# EAGLE design pragotron-master-clock-1.0 (EAGLE 9.6.2)
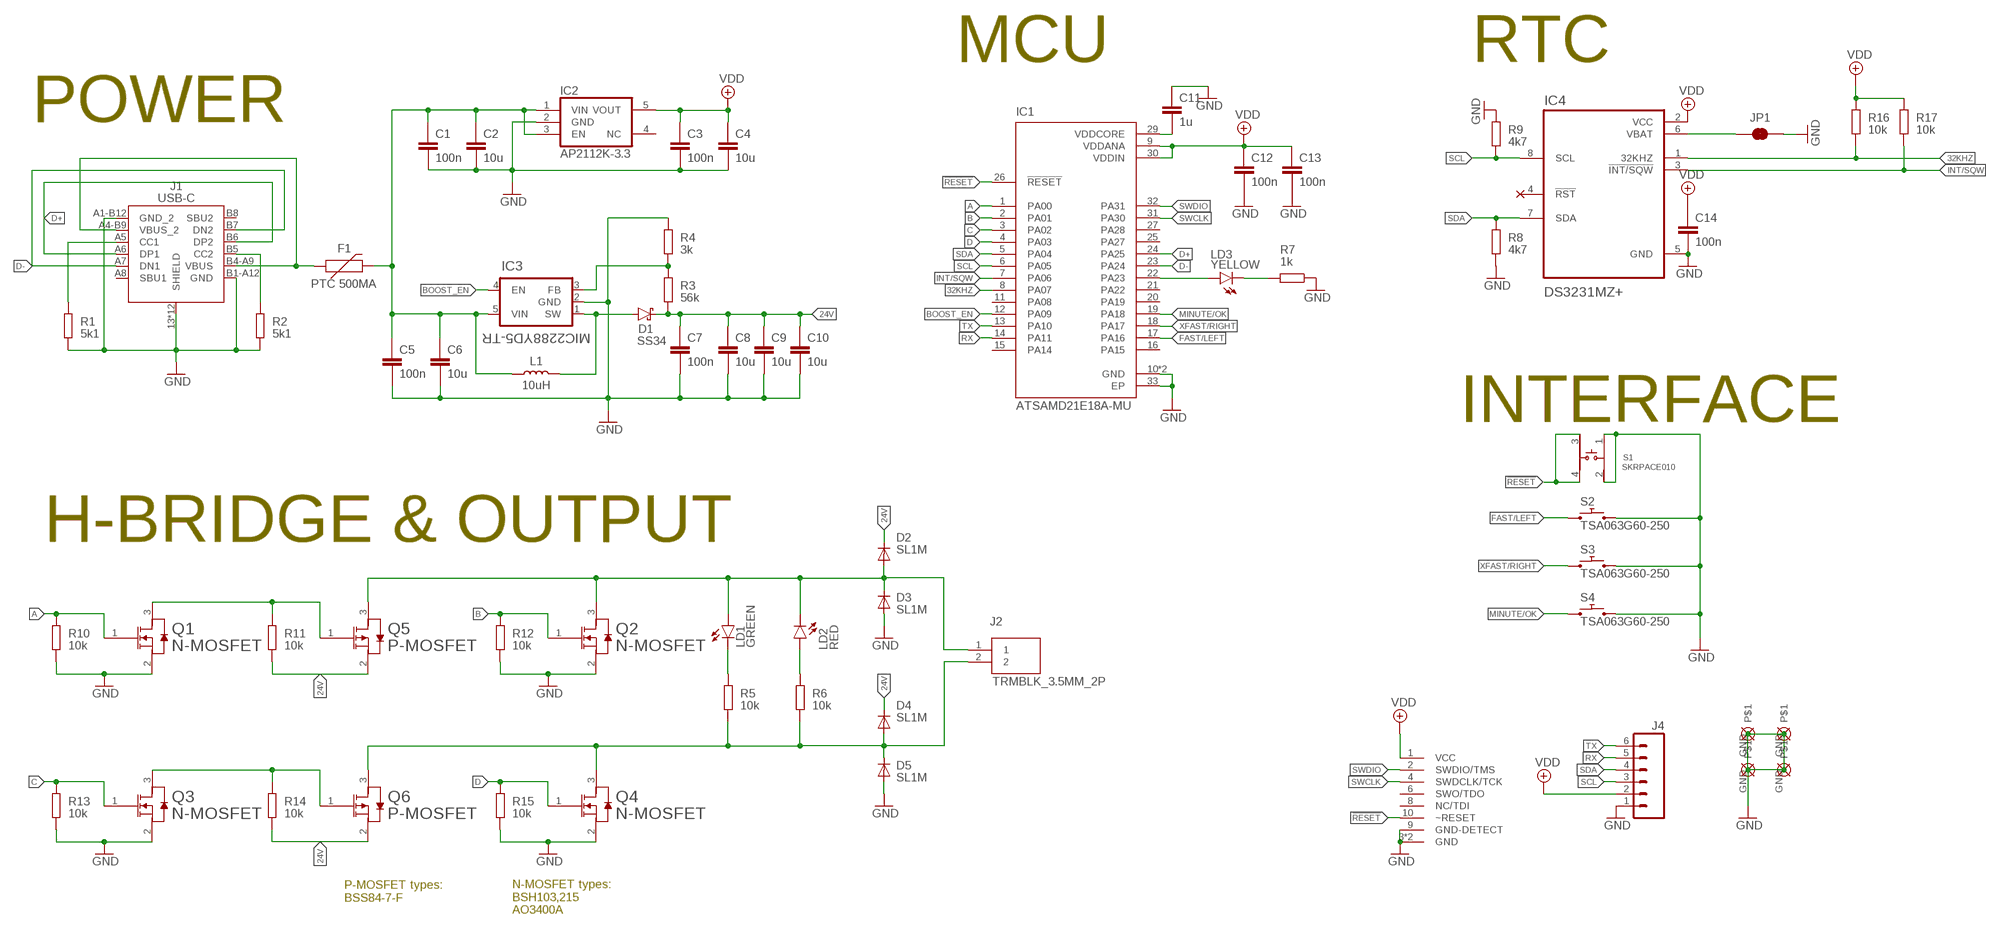
[diagram p0: schematic, sheet 1]

## Parts
C1  100n  CAPACITOR0603  [CAPACITOR0603]
C2  10u  CAPACITOR0805  [CAPACITOR0805]
C3  100n  CAPACITOR0603  [CAPACITOR0603]
C4  10u  CAPACITOR0805  [CAPACITOR0805]
C5  100n  CAPACITOR0603  [CAPACITOR0603]
C6  10u  CAPACITOR0805  [CAPACITOR0805]
C7  100n  CAPACITOR0603  [CAPACITOR0603]
C8  10u  CAPACITOR0805  [CAPACITOR0805]
C9  10u  CAPACITOR0805  [CAPACITOR0805]
C10  10u  CAPACITOR0805  [CAPACITOR0805]
C11  1u  CAPACITOR0603  [CAPACITOR0603]
C12  100n  CAPACITOR0603  [CAPACITOR0603]
C13  100n  CAPACITOR0603  [CAPACITOR0603]
C14  100n  CAPACITOR0603  [CAPACITOR0603]
D1  SS34  [SMA]
D2  SL1M  [SOD123]
D3  SL1M  [SOD123]
D4  SL1M  [SOD123]
D5  SL1M  [SOD123]
F1  PTC 500MA  PTC200MA  [PTC0805]
H1  HOLE_3MM_GND_CORNER  [3MM_HOLE_GND_CORNER]
H2  HOLE_3MM_GND_CORNER  [3MM_HOLE_GND_CORNER]
H3  HOLE_3MM_GND_CORNER  [3MM_HOLE_GND_CORNER]
H4  HOLE_3MM_GND_CORNER  [3MM_HOLE_GND_CORNER]
IC1  ATSAMD21E18A-MU  [QFN50P500X500X100-33N]
IC2  AP2112K-3.3  AP2205-W5-7  [SOT23-5]
IC3  MIC2288YD5-TR  [SOT23-5]
IC4  DS3231MZ+  [SO8]
J1  USB-C  [USB-C]
J2  TRMBLK_3.5MM_2P  [TRMBLK_3.5MM_2P]
J3  2X5_PITCH_1.27MMTH_NOKEY_UNSHROUDED  [CON-CORTEX_2X5_0.05"_TH_NS]
J4  M06NO_SILK  [1X06_NO_SILK]
JP1  JUMPER-SMT_2_NC_TRACE_NO-SILK  [SMT-JUMPER_2_NC_TRACE_NO-SILK]
L1  10uH  ETQP3MXXXKVP  [ETQP3MXXXKVP]
LD1  GREEN  LED_SMT  [LED_0603]
LD2  RED  LED_SMT  [LED_0603]
LD3  YELLOW  LED_SMT  [LED_0603]
Q1  N-MOSFET  [SOT23]
Q2  N-MOSFET  [SOT23]
Q3  N-MOSFET  [SOT23]
Q4  N-MOSFET  [SOT23]
Q5  P-MOSFET  [SOT23]
Q6  P-MOSFET  [SOT23]
R1  5k1  RESISTOR0603  [RESISTOR0603]
R2  5k1  RESISTOR0603  [RESISTOR0603]
R3  56k  RESISTOR0603  [RESISTOR0603]
R4  3k  RESISTOR0603  [RESISTOR0603]
R5  10k  RESISTOR0603  [RESISTOR0603]
R6  10k  RESISTOR0603  [RESISTOR0603]
R7  1k  RESISTOR0603  [RESISTOR0603]
R8  4k7  RESISTOR0603  [RESISTOR0603]
R9  4k7  RESISTOR0603  [RESISTOR0603]
R10  10k  RESISTOR0603  [RESISTOR0603]
R11  10k  RESISTOR0603  [RESISTOR0603]
R12  10k  RESISTOR0603  [RESISTOR0603]
R13  10k  RESISTOR0603  [RESISTOR0603]
R14  10k  RESISTOR0603  [RESISTOR0603]
R15  10k  RESISTOR0603  [RESISTOR0603]
R16  10k  RESISTOR0603  [RESISTOR0603]
R17  10k  RESISTOR0603  [RESISTOR0603]
S1  SKRPACE010  [SKRPACE010]
S2  TSA063G60-250  PUSH_MOMENTARY_SMT_6X6MM_SMALL_PADS  [TACTILE-SMT-SMALL-PADS]
S3  TSA063G60-250  PUSH_MOMENTARY_SMT_6X6MM_SMALL_PADS  [TACTILE-SMT-SMALL-PADS]
S4  TSA063G60-250  PUSH_MOMENTARY_SMT_6X6MM_SMALL_PADS  [TACTILE-SMT-SMALL-PADS]

## Nets
24V: C7.1 C8.1 C9.1 C10.1 D1.C D2.C D4.C Q5.2(SOURCE) Q6.2(SOURCE) R3.1 R11.1 R14.1
32KHZ: IC1.8(PA07) IC4.1(32KHZ) R16.1
!RESET: IC1.26(!RESET) J3.10(~RESET) S1.3 S1.4
A: IC1.1(PA00) Q1.1(GATE) R10.2
B: IC1.2(PA01) Q2.1(GATE) R12.2
BOOST_EN: IC1.12(PA09) IC3.4(EN)
C: IC1.3(PA02) Q3.1(GATE) R13.2
D: IC1.4(PA03) Q4.1(GATE) R15.2
D+: IC1.24(PA25) J1.A6(DP1) J1.B6(DP2)
D-: IC1.23(PA24) J1.A7(DN1) J1.B7(DN2)
FAST/LEFT: IC1.17(PA16) S2.1 S2.2
GND: C1.2 C2.2 C3.2 C4.2 C5.2 C6.2 C7.2 C8.2 C9.2 C10.2 C11.1 C12.2 C13.2 C14.2 D3.A D5.A H1.GND H2.GND H3.GND H4.GND IC1.10(GND) IC1.28(GND) IC1.33(EP) IC2.2(GND) IC3.2(GND) IC4.5(GND) J1.13(SHIELD) J1.14(SHIELD) J1.15(SHIELD) J1.16(SHIELD) J1.A1-B12(GND_2) J1.B1-A12(GND) J1.S_1_H1(SHIELD) J1.S_1_H2(SHIELD) J1.S_2_H1(SHIELD) J1.S_2_H2(SHIELD) J1.S_3_H1(SHIELD) J1.S_3_H2(SHIELD) J1.S_4_H1(SHIELD) J1.S_4_H2(SHIELD) J3.3(GND) J3.5(GND) J3.9(GND-DETECT) J4.1 JP1.2 Q1.2(SOURCE) Q2.2(SOURCE) Q3.2(SOURCE) Q4.2(SOURCE) R1.1 R2.1 R4.2 R7.1 R8.1 R9.2 R10.1 R12.1 R13.1 R15.1 S1.1 S1.2 S2.3 S2.4 S3.3 S3.4 S4.3 S4.4
INT/SQW: IC1.7(PA06) IC4.3(!INT/SQW) R17.1
MINUTE/OK: IC1.19(PA18) S4.1 S4.2
N$1: IC3.3(FB) R3.2 R4.1
N$2: D1.A IC3.1(SW) L1.2
N$3: F1.2 J1.A4-B9(VBUS_2) J1.B4-A9(VBUS)
N$4: C1.1 C2.1 C5.1 C6.1 F1.3 IC2.1(VIN) IC2.3(EN) IC3.5(VIN) L1.1
N$5: J1.A5(CC1) R1.2
N$6: J1.B5(CC2) R2.2
N$8: LD2.A R6.2
N$9: C11.2 IC1.29(VDDCORE)
N$10: IC1.22(PA23) LD3.A
N$11: LD3.K(C) R7.2
N$12: IC4.6(VBAT) JP1.1
N$13: LD1.K(C) R5.2
N$17: Q1.3(DRAIN) Q5.1(GATE) R11.2
N$19: Q3.3(DRAIN) Q6.1(GATE) R14.2
OUT_1: D2.A D3.C J2.1 LD1.A LD2.K(C) Q2.3(DRAIN) Q5.3(DRAIN)
OUT_2: D4.A D5.C J2.2 Q4.3(DRAIN) Q6.3(DRAIN) R5.1 R6.1
RX: IC1.14(PA11) J4.5
SCL: IC1.6(PA05) IC4.8(SCL) J4.3 R9.1
SDA: IC1.5(PA04) IC4.7(SDA) J4.4 R8.2
SWCLK: IC1.31(PA30) J3.4(SWDCLK/TCK)
SWDIO: IC1.32(PA31) J3.2(SWDIO/TMS)
TX: IC1.13(PA10) J4.6
VDD: C3.1 C4.1 C12.1 C13.1 C14.1 IC1.9(VDDANA) IC1.30(VDDIN) IC2.5(VOUT) IC4.2(VCC) J3.1(VCC) J4.2 R16.2 R17.2
XFAST/RIGHT: IC1.18(PA17) S3.1 S3.2
Unconnected: IC1.11(PA08) IC1.15(PA14) IC1.16(PA15) IC1.20(PA19) IC1.21(PA22) IC1.25(PA27) IC1.27(PA28) IC2.4(NC) IC4.4(!RST) J1.A8(SBU1) J1.B8(SBU2) J3.6(SWO/TDO) J3.8(NC/TDI)

## Notes on the sheet
- MCU | RTC
- POWER
- INTERFACE
- H-BRIDGE & OUTPUT
- P-MOSFET types:
  BSS84-7-F
- N-MOSFET types:
  BSH103,215
  AO3400A

## Library data of the parts
C1 C3 C5 C7 C11-C14 = BASTL_CAPACITORS:CAPACITOR0603; ODOO: 0.1; SIZEX: 0.85; SIZEY: 1.55; SIZEZ: 0.8; TYPE: SMT
C2 C4 C6 C8-C10 = BASTL_CAPACITORS:CAPACITOR0805; ODOO: 0.1; SIZEX: 1.2; SIZEY: 2; SIZEZ: 1.2; TYPE: SMT
D1 = BASTL_DIODES:SS34: Diode Schottky 40V 3A 2-Pin SMA
D2-D5 = BASTL_DIODES:SL1M: diode instead of 1N4007; MAN: DIOTEC SEMICONDUCTOR; MPN: SL1M; ODOO: D_SL1M_SOD123; PRICE: 0.5; SIZEX: 1.55; SIZEY: 2.65; SIZEZ: 0.9; TYPE: SMT; WEB: https://www.tme.eu/cz/details/sl1m-dio/univerzalni-diody-smd/diotec-semiconductor/sl1m/
F1 = BASTL_FUSES:PTC; MAN: ECE; MPN: SR020-09; ODOO: F_PTC_200MA_0805; PRICE: 3.2; SIZEX: 1.2; SIZEY: 2; SIZEZ: 0.5; TYPE: SMT; WEB: https://www.tme.eu/cz/details/sr020-09/polymerove-pojistky-smd/ece/
H1-H4 = BASTL_HOLES:HOLE_3MM_GND
IC1 = BASTL_ICS:ATSAMD21E18A-MU: SAMD21E Series 256 KB Flash 32 KB SRAM 48 MHz 32-Bit Microcontroller - QFN-32; CHECK_PRICES: https://www.snapeda.com/parts/ATSAMD21E18A-MU/Microchip/view-part/?ref=eda; DESCRIPTION: ARM® Cortex®-M0+ SAM D21E, Functional Safety (FuSa) Microcontroller IC 32-Bit Single-Core 48MHz 256KB (256K x 8) FLASH 32-VQFN (5x5); DIGIKEY_PART_NUMBER: ATSAMD21E18A-MU-ND; MF: Microchip; MP: ATSAMD21E18A-MU; PACKAGE: QFN-32 Microchip; PURCHASE-URL: https://www.snapeda.com/api/url_track_click_mouser/?unipart_id=227694&manufacturer=Microchip&part_name=ATSAMD21E18A-MU&search_term=None; SNAPEDA_LINK: https://www.snapeda.com/parts/ATSAMD21E18A-MU/Microchip/view-part/?ref=snap
IC2 = BASTL_VOLTAGE REGULATORS:AP2205-W5-7: alt: AP2204K-5.0TRG1 AP2205-W5-7 LD2985BM50R LP2981AIM5-5.0/NOPB
IC3 = BASTL_ICS:MIC2288YD5-TR: DigiKey, Mouser: MIC2288YD5-TR LCSC: MT3540-F23
IC4 = BASTL_ICS:DS3231MZ+; DESCRIPTION: Real Time Clock (RTC) IC Clock/Calendar I²C, 2-Wire Serial 8-SOIC (0.154, 3.90mm Width); DIGI-KEY_PART_NUMBER: DS3231MZ+-ND; MF: Maxim Integrated Products; MP: DS3231MZ+; PACKAGE: None
J1 = BASTL_CONNECTORS:USB-C: DigiKey: USB4105-GF-A LCSC: C165948
J2 = BASTL_CONNECTORS:TRMBLK_3.5MM_2P: TE 1546551-2 Würth Elektronik 691214110002 Phoenix Contact 5442248 Adam Tech EBWA-02-A
J3 = BASTL_PINHEADER_1.27mm:2X5_PITCH_1.27MM; TYPE: THT
J4 = BASTL_PINHEADERS:M06: Header 6 Standard 6-pin 0.1" header. Use with straight break away headers (SKU : PRT-00116), right angle break away headers (PRT-00553), swiss pins (PRT-00743), machine pins (PRT-00117), and female headers (PRT-00115). Molex polarized connector foot print use with SKU : PRT-08094 with associated crimp pins and housings. NOTES ON THE VARIANTS LOCK and LOCK_LONGPADS... This footprint was designed to help hold the alignment of a through-hole component (i.e. 6-pin header) while soldering it into place. You may notice that each hole has been shifted either up or down by 0.005 of an inch from it's more standard position (which is a perfectly straight line). This slight alteration caused the pins (the squares in the middle) to touch the edges of the holes. Because they are alternating, it causes a "brace" to hold the component in place. 0.005 has proven to be the perfect amount of "off-center" position when using our standard breakaway headers. Although looks a little odd when you look at the bare footprint, once you have a header in there, the alteration is very hard to notice. Also,if you push a header all the way into place, it is covered up entirely on the bottom side. This idea of altering the position of holes to aid alignment will be further integrated into the Sparkfun Library for other footprints. It can help hold any component with 3 or more connection pins.
JP1 = BASTL_JUMPERS:JUMPER-SMT_2_NC_TRACE: Normally closed trace jumper This jumper has a trace between two pads so it's normally closed (NC). Use a razor knife to open the connection. For best results follow the IPC guidelines for cutting traces: Cutout at least 0.063 mm (0.005 in). Remove all loose material to clean up the cut area. Seal the cut with an approved epoxy. Reapply solder to reclose the connection.
L1 = BASTL_INDUCTORS:ETQP3MXXXKVP; DIGI-KEY_PART_NUMBER: P19755TR-ND; MF: Panasonic; MP: ETQP3M100KVP
LD1-LD3 = BASTL_LEDS:LED_SMT; TYPE: SMT
Q1-Q4 = BASTL_TRANZISTORS:N-MOSFET
Q5 Q6 = BASTL_TRANZISTORS:P-MOSFET
R1-R17 = BASTL_RESISTORS:RESISTOR0603; ASSEMBLED: yes; PRICE: 0.1; SIZEX: 0.85; SIZEY: 1.55; SIZEZ: 0.5; TYPE: SMT
S1 = BASTL_SWITCHES:SKRPACE010: Switch Tactile N.O. SPST Button J-Bend 0.05A 16VDC 2.55N SMD Automotive T/R Check availability <https://pricing.snapeda.com/parts/SKRPACE010/ALPS/view-part?ref=eda>; AVAILABILITY: In Stock; CHECK_PRICES: https://www.snapeda.com/parts/SKRPACE010/ALPS/view-part/?ref=eda; DESCRIPTION: Switch Tactile N.O. SPST Button J-Bend 0.05A 16VDC 2.55N SMD Automotive T/R; MF: ALPS; MP: SKRPACE010; PACKAGE: None; PRICE: None; PURCHASE-URL: https://www.snapeda.com/api/url_track_click_mouser/?unipart_id=376136&manufacturer=ALPS&part_name=SKRPACE010&search_term=None; SNAPEDA_LINK: https://www.snapeda.com/parts/SKRPACE010/ALPS/view-part/?ref=snap
S2-S4 = BASTL_SWITCHES:PUSH_MOMENTARY: Various NO switches- pushbuttons, reed, etc THT: TL1105SPF100Q SMT: TL3301SPF100QG, TL3301SPF160QG...

## Board
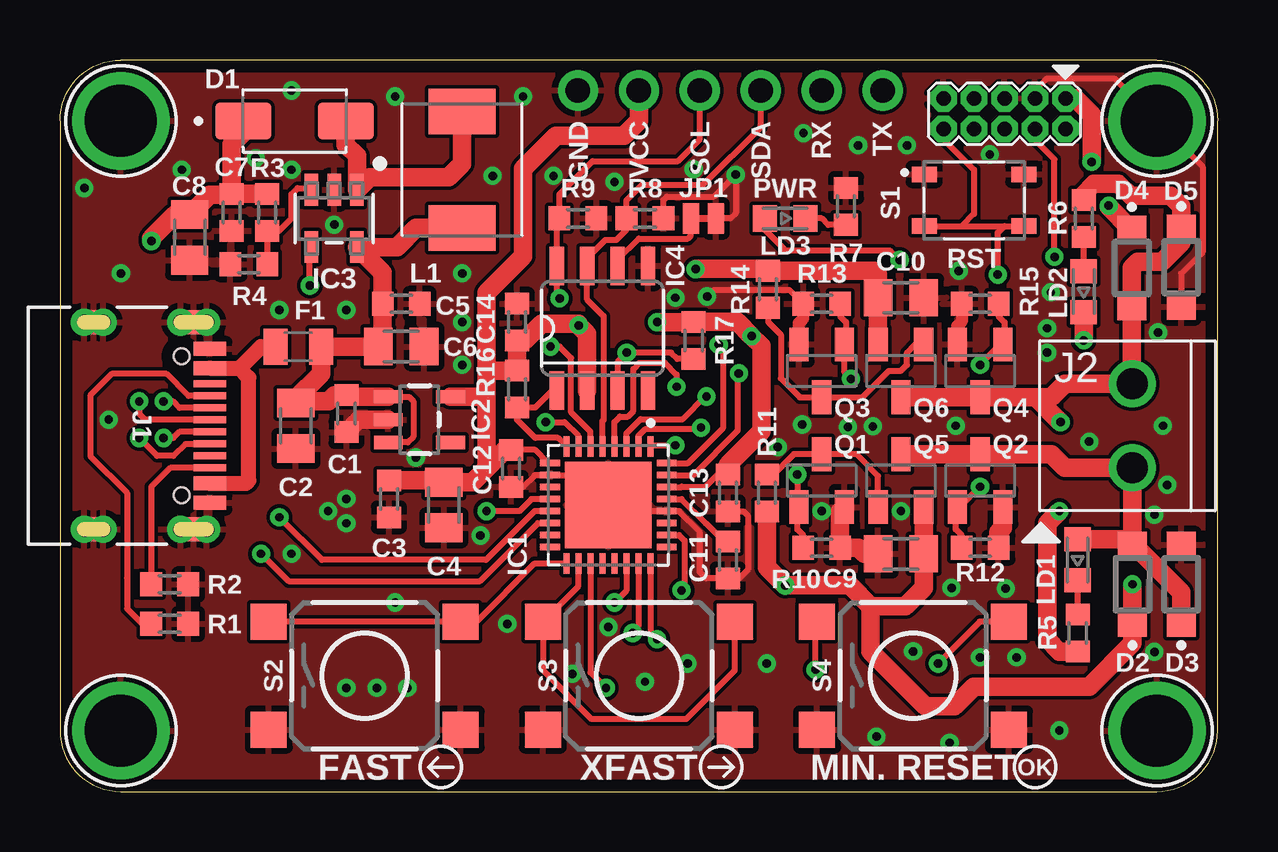
[diagram p1: board, top side]
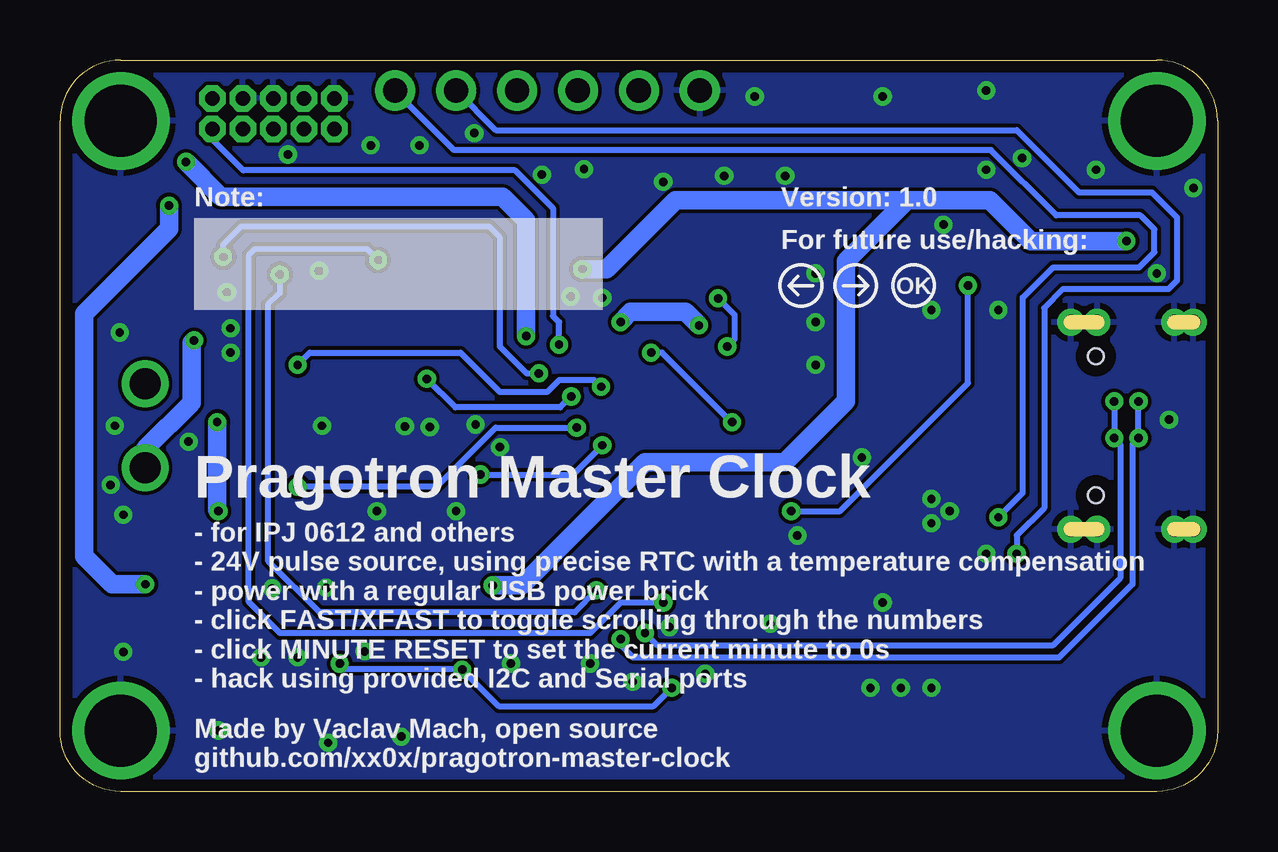
[diagram p2: board, bottom side, seen from below]

Size 48.26 x 30.48 mm. Coordinates in mm from the lower left corner, seen from the top.
Outline: 2.54,0 45.72,0 arc90 48.26,2.54 48.26,27.94 arc90 45.72,30.48 2.54,30.48 arc90 0,27.94 0,2.54 arc90 2.54,0
Copper layers (1*16): Top 0.035mm / dielectric 1.5mm / Bottom 0.035mm
Design rules "default_tenting_vias": minimum track width 6mil, minimum drill 0.35mm, track to track 6mil, track to pad 6mil, pad to pad 6mil, via to via 6mil, smd to smd 6mil, copper to edge 20mil, drill to drill 6mil, minimum pad ring 10mil, minimum via ring 8mil, stop-mask expansion 4mil, vias tented up to drill 15mil, thermal gap 10mil

### Footprints (pad centres in the part's own frame; a part is rotated, then mirrored left to right if it is on the bottom)
CAPACITOR0603 = smd 0.9 x 1: 1 -0.771,0; 2 0.771,0
CAPACITOR0805 = smd 1.2 x 1.55: 1 -0.95,0; 2 0.95,0
SMA = smd 2.33 x 1.55: A 2.135,0; C -2.135,0
SOD123 = smd 1.05 x 1.2: A 1.654,0; C -1.654,0
PTC0805 = smd 1 x 1.5: 2 0.921,0; 3 -0.972,0
3MM_HOLE_GND_CORNER = drill 3 pad 4.064: GND 0,0
QFN50P500X500X100-33N = smd 0.84 x 0.26: 1 -2.435,1.75; 2 -2.435,1.25; 3 -2.435,0.75; 4 -2.435,0.25; 5 -2.435,-0.25; 6 -2.435,-0.75; 7 -2.435,-1.25; 8 -2.435,-1.75; 17 2.435,-1.75; 18 2.435,-1.25; 19 2.435,-0.75; 20 2.435,-0.25; 21 2.435,0.25; 22 2.435,0.75; 23 2.435,1.25; 24 2.435,1.75 | smd 0.26 x 0.84: 9 -1.75,-2.435; 10 -1.25,-2.435; 11 -0.75,-2.435; 12 -0.25,-2.435; 13 0.25,-2.435; 14 0.75,-2.435; 15 1.25,-2.435; 16 1.75,-2.435; 25 1.75,2.435; 26 1.25,2.435; 27 0.75,2.435; 28 0.25,2.435; 29 -0.25,2.435; 30 -0.75,2.435; 31 -1.25,2.435; 32 -1.75,2.435 | smd 3.6 x 3.6: 33 0,0
SOT23-5 = smd 0.55 x 1.2: 1 -0.95,-1.3; 2 0,-1.3; 3 0.95,-1.3; 4 0.95,1.3; 5 -0.95,1.3
SOT23-5' = smd 1.321 x 0.559: 1 -1.194,0.95; 2 -1.194,0; 3 -1.194,-0.95; 4 1.194,-0.95; 5 1.194,0.95
SO8 = smd 1.6 x 0.6: 1 -2.6,1.905; 2 -2.6,0.635; 3 -2.6,-0.635; 4 -2.6,-1.905; 5 2.6,-1.905; 6 2.6,-0.635; 7 2.6,0.635; 8 2.6,1.905
USB-C = smd 0.991 x 1.803: 13 -4.32,-1.269; 14 4.32,-1.269 | smd 0.991 x 2.108: 15 -4.32,2.911; 16 4.32,2.911 | smd 0.584 x 1.372: A1-B12 -3.2,3.581; A4-B9 -2.4,3.581; B1-A12 3.2,3.581; B4-A9 2.4,3.581 | smd 0.305 x 1.372: A5 -1.25,3.581; A6 -0.25,3.581; A7 0.25,3.581; A8 1.25,3.581; B5 1.75,3.581; B6 0.75,3.581; B7 -0.75,3.581; B8 -1.75,3.581 | drill 0.61 pad 0.61: S_1_H1 -4.318,-0.864; S_1_H2 -4.318,-1.651; S_2_H1 4.318,-0.864; S_2_H2 4.318,-1.651; S_3_H1 -4.318,3.454; S_3_H2 -4.318,2.362; S_4_H1 4.318,3.454; S_4_H2 4.318,2.362 | hole 0.65: 2.896,2.413; -2.896,2.413
TRMBLK_3.5MM_2P = drill 1.3: 1 -1.75,0; 2 1.75,0
CON-CORTEX_2X5_0.05"_TH_NS = drill 0.6 pad 0.889 octagon: 1 -2.54,-0.635; 2 -2.54,0.635; 3 -1.27,-0.635; 4 -1.27,0.635; 5 0,-0.635; 6 0,0.635; 7 1.27,-0.635; 8 1.27,0.635; 9 2.54,-0.635; 10 2.54,0.635
1X06_NO_SILK = drill 1.016 pad 1.676: 1 0,0; 2 2.54,0; 3 5.08,0; 4 7.62,0; 5 10.16,0; 6 12.7,0
SMT-JUMPER_2_NC_TRACE_NO-SILK = smd 0.66 x 1.27: 1 -0.521,0; 2 0.521,0
ETQP3MXXXKVP = smd 1.905 x 2.79: 1 -2.425,0; 2 2.425,0
LED_0603 = smd 1 x 1.1: A 0.85,0; K -0.85,0
SOT23 = smd 0.8 x 1.4: 1 -0.95,-1.1; 2 0.95,-1.1; 3 0,1.1
RESISTOR0603 = smd 0.9 x 1: 1 -0.771,0; 2 0.771,0
SKRPACE010 = smd 1.05 x 0.65: 1 -2.075,1.075; 2 2.075,1.075; 3 -2.075,-1.075; 4 2.075,-1.075
TACTILE-SMT-SMALL-PADS = smd 1.5 x 1.5: 1 -4,2.25; 2 4,2.25; 3 -4,-2.25; 4 4,-2.25

### Placement (x,y rotation side)
C1  11.94,15.75 270 top
C2  9.83,15.24 270 top
C3  13.72,12.19 270 top
C4  16,11.94 270 top
C5  14.22,20.32 0 top
C6  14.22,18.54 0 top
C7  7.16,24.13 270 top
C8  5.41,23.09 270 top
C9  35.05,9.91 180 top
C10  35.05,20.57 0 top
C11  27.84,9.65 90 top
C12  18.8,13.46 270 top
C13  27.84,12.45 270 top
C14  19.05,19.56 90 top
D1  9.78,27.94 0 top
D2  44.7,8.64 90 top
D3  46.74,8.64 90 top
D4  44.68,21.82 270 top
D5  46.74,21.84 270 top
F1  9.91,18.54 180 top
H1  2.54,2.54 0 top
H2  2.54,27.94 0 top
H3  45.72,27.94 0 top
H4  45.72,2.54 0 top
IC1  22.86,11.94 270 top
IC2  14.99,15.49 270 top
IC3  MIC2288YD5-TR  [SOT23-5']  11.43,23.88 270 top
IC4  22.61,19.3 90 top
J1  2.67,15.24 270 top
J2  44.7,15.24 90 top
J3  39.37,28.24 180 top
J4  21.59,29.21 0 top
JP1  26.82,23.88 0 top
L1  16.76,25.91 90 top
LD1  42.42,9.65 90 top
LD2  42.67,20.83 90 top
LD3  30.23,23.88 180 top
Q1  31.75,12.95 0 top
Q2  38.35,12.95 0 top
Q3  31.75,17.53 180 top
Q4  38.35,17.53 180 top
Q5  35.05,12.95 0 top
Q6  35.05,17.53 180 top
R1  4.57,6.99 180 top
R2  4.57,8.64 180 top
R3  8.64,24.13 270 top
R4  7.87,21.97 180 top
R5  42.42,6.6 90 top
R6  42.67,23.88 270 top
R7  32.77,24.38 270 top
R8  24.38,23.88 180 top
R9  21.59,23.88 0 top
R10  31.75,10.16 180 top
R11  29.46,12.45 90 top
R12  38.35,10.16 180 top
R13  31.75,20.32 0 top
R14  29.51,20.93 270 top
R15  38.35,20.32 0 top
R16  19.05,16.76 90 top
R17  26.42,18.8 90 top
S1  38.1,24.64 0 top
S2  12.7,4.83 0 top
S3  24.13,4.83 0 top
S4  35.56,4.83 0 top

### Tracks (layer width: path | path; a pad name or v marks a point on that pad's centre or on a via)
24V  (via drill 0.35)
  Top 0.762: Q6.2 C10.1 34.1,21.52 33.93,21.69 29.52,21.69 R14.1 29.44,21.78 26.5,21.78 v26.49,21.77 | Q5.2 C9.1 36,8.49 35.23,7.72 33.78,7.72 | D4.C 44.6,23.47 43.71,24.36 v43.71,24.41 | 33.78,7.72 32.92,8.59 v30.23,8.59 29.46,9.35 R11.1 | v44.7,8.64 D2.C 44.7,6.17 42.9,4.37 38.1,4.37 37.29,3.56 36.07,3.56 33.78,5.84 33.78,7.72 | D1.C 7.64,27.46 7.16,26.98 C7.1 | R3.1 C7.1 | C7.1 7.14,24.88 6.25,24.88 C8.1 4.79,24.04 3.81,23.06 v3.81,22.94
  Bottom 0.762: v43.71,24.41 43.71,23.44 47.24,19.91 47.24,9.8 46.08,8.64 v44.7,8.64 | v26.49,21.77 25.48,21.77 22.61,24.64 12.95,24.64 | 12.95,24.64 9.5,24.64 7.8,22.94 v3.81,22.94 | v30.23,8.59 29.01,8.59 23.88,13.72 18.03,13.72 15.49,16.26 15.49,22.1 12.95,24.64
32KHZ
  Top 0.254: IC1.8 20.75,14.73 19.81,14.73 19.05,15.49 R16.1 19.8,15.99 20.51,16.7 IC4.1
!RESET  (via drill 0.35)
  Top 0.254: IC1.26 25.8,10.69 26.04,10.46 26.04,8.51 v25.91,8.38 | S1.4 40.17,23.57 40.16,23.56 39.37,23.56 | S1.3 37.59,23.56 | 37.59,23.56 39.37,23.56 | v39.09,21.54 39.09,23.28 39.37,23.56 | J3.10 36.83,27.18 38.1,25.91 38.1,24.07 37.59,23.56
  Bottom 0.254: v25.91,8.38 25.91,8.36 26.8,7.47 37.44,7.47 39.57,9.6 39.57,20.3 39.09,20.78 v39.09,21.54
A  (via drill 0.35)
  Top 0.254: R10.2 30.98,10.68 30.73,10.92 30.73,11.79 | 30.73,11.79 Q1.1 | IC1.1 24.66,14.43 v25.65,14.43 | v30.73,13.21 30.73,11.79
  Bottom 0.254: v30.73,13.21 26.87,13.21 v25.65,14.43
B  (via drill 0.35)
  Top 0.254: R12.2 37.58,10.68 37.34,10.92 37.34,11.79 Q2.1 37.51,11.85 v38.35,12.7 | IC1.2 24.11,14.81 24.38,15.09 26.64,15.09 v26.72,15.16
  Bottom 0.254: v26.72,15.16 30.1,15.16 32.56,12.7 v38.35,12.7
BOOST_EN  (via drill 0.35)
  Top 0.254: IC1.12 19.66,12.19 19.15,11.68 v17.78,11.68 | v10.41,21.08 10.41,22.62 IC3.4
  Bottom 0.254: v17.78,11.68 15.75,11.68 10.41,17.02 v10.41,21.08
C  (via drill 0.35)
  Top 0.254: R13.2 32.52,19.8 32.77,19.56 32.77,18.69 Q3.1 32.7,17.46 v32.97,17.2 | IC1.3 23.61,14.92 24.21,15.52 25.96,15.52 26.9,16.46 v26.95,16.46
  Bottom 0.254: v26.95,16.46 27.41,16 31.77,16 v32.97,17.2
D  (via drill 0.35)
  Top 0.254: R15.2 39.12,19.8 39.37,19.56 39.37,18.69 Q4.1 39.2,18.63 v38.35,17.78 | v25.7,16.87 25.7,17.37 25.22,17.86 24.16,17.86 23.9,17.6 23.9,15.85 23.67,15.62 23.34,15.62 23.11,15.39 IC1.4
  Bottom 0.254: v25.7,16.87 25.98,17.14 27.46,17.14 27.96,16.64 29.92,16.64 31.57,18.29 37.85,18.29 v38.35,17.78
D+  (via drill 0.35)
  Top 0.254: IC1.24 24.61,6.63 v24.89,6.35 | v3.3,14.73 4.05,13.98 4.72,13.98 5.23,14.49 J1.B6 | v3.3,16.26 3.3,15.75 3.56,15.49 J1.A6
  Bottom 0.254: v24.89,6.35 24.89,6.1 24.38,5.59 6.6,5.59 3.56,8.64 3.56,14.48 v3.3,14.73 v3.3,16.26
D-  (via drill 0.35)
  Top 0.254: IC1.23 24.11,6.88 23.88,6.64 v23.88,6.6 | J1.A7 4.98,14.99 4.72,14.73 v4.32,14.73 | J1.B7 4.98,15.99 4.71,16.26 v4.32,16.26
  Bottom 0.254: v23.88,6.6 23.37,6.1 6.86,6.1 4.06,8.89 4.06,14.48 v4.32,14.73 v4.32,16.26
FAST/LEFT
  Top 0.254: IC1.17 19.79,9.5 17.36,7.08 S2.2 S2.1
GND  (via drill 0.35)
  Top 0.254: v26.98,20.62 27.25,20.9 30.39,20.9 R13.1 | C12.2 19.3,12.69 19.8,13.19 IC1.10 21.61,13.19 IC1.33 23.11,11.69 IC1.28 25.8,11.69 26.67,10.82 26.67,9.14 26.93,8.88 C11.1 28.32,8.88 28.68,9.24 28.68,11.48 28.48,11.68 C13.2 | R8.1 25.16,24.65 25.3,24.79 27.25,24.79 v28.17,25.7 28.17,24.11 27.94,23.88 JP1.2 | J3.3 40.64,29.21 41.15,29.72 43.94,29.72 H3.GND 47.62,26.04 47.62,22.48 46.74,21.59 D5.A
  Top 0.508: R15.1 37.58,19.57 37.4,19.39 Q4.2 | Q3.2 30.8,19.52 30.98,19.7 R13.1
  Top 0.762: Q1.2 32.52,11.68 R10.1 33.27,10.16 33.53,9.91 C9.2 | IC2.2 12.46,15.49 C1.2 | R12.1 39.12,10.8 39.3,10.98 Q2.2
  other vias: 2.03,15.49 1.02,25.15 9.65,29.21 13.97,28.96 19.3,28.96 18.03,25.65 16.76,21.59 16.76,17.78 14.83,13.92 11.94,11.18 11.94,12.19 11.18,11.68 17.53,10.67 14.48,4.32 13.21,4.32 11.94,4.32 13.97,7.87 24.38,4.57 22.86,6.86 21.36,4.9 26.16,5.33 29.46,5.33 35.56,5.84 38.35,5.59 39.88,5.59 34.04,2.29 41.66,2.54 45.62,5.82 45.62,11.53 46.15,12.78 42.9,14.58 32.84,15.19 33.88,15.21 31.75,11.68 35.05,11.68 29.92,14.35 37.34,15.24 41.15,19.3 41.15,18.29 45.77,19.13 41.3,20.8 37.47,21.69 33.27,26.92 35.31,26.92 30.99,27.43 23.11,25.4 20.57,25.65 26.42,25.93 25.65,20.57 16.76,19.56 11.94,20.07 9.14,20.07 5.08,25.91 8.15,26.39 9.65,25.91 11.43,23.62 30.94,15.29 38.76,26.54 39.42,8.46 18.64,6.99 37.16,8.48 45.97,15.24 37.08,2.03 9.65,9.91 2.54,21.59
  pour Top: 0,30.48 48.26,30.48 48.26,0 0,0
  pour Bottom: 0,30.48 48.26,30.48 48.26,0 0,0
INT/SQW  (via drill 0.35)
  Top 0.254: IC4.3 23.24,17.91 v23.62,18.29 25.48,18.29 25.74,18.02 R17.1 | IC1.7 21.61,14.81 21.03,15.39 v20.24,15.39
  Bottom 0.254: v20.24,15.39 20.27,15.39 23.16,18.29 v23.62,18.29
MINUTE/OK  (via drill 0.35)
  Top 0.254: IC1.19 22.11,4.97 v22.76,4.32 | v31.5,5.08 31.5,7.01 S4.1 | S4.2 38.34,7.08 v36.6,5.33
  Bottom 0.254: v22.76,4.32 23.52,3.56 29.97,3.56 v31.5,5.08 31.52,5.11 36.37,5.11 v36.6,5.33
N$1
  Top 0.254: R4.1 R3.2 9.13,23.36 9.65,23.88 9.65,24.89 9.91,25.15 10.4,25.15 IC3.3
N$2
  Top 0.762: L1.2 16.76,26.16 16.2,25.6 12.91,25.6 IC3.1 12.38,26.48 11.91,26.95 D1.A
N$3
  Top 0.635: J1.A4-B9 7.48,17.64 | F1.2 8.38,18.54 7.48,17.64 | J1.B4-A9 7.76,12.84 7.87,12.95 7.87,17.25 7.48,17.64
N$4
  Top 0.254: IC2.1 14.54,16.44 14.73,16.26 14.73,14.78 14.49,14.54 IC2.3
  Top 0.762: L1.1 14.85,23.48 14.05,22.68 IC3.5 13.45,21.61 C5.1 13.45,18.72 C6.1 F1.3 10.88,17.41 9.83,16.36 C2.1 9.91,16.27 11.2,16.27 11.46,16.52 C1.1 12.01,16.44 IC2.1
N$5
  Top 0.254: J1.A5 5.35,16.49 4.45,17.4 2.16,17.4 1.27,16.51 1.27,13.97 2.79,12.45 2.79,8.89 2.79,7.62 3.43,6.99 R1.2
N$6
  Top 0.254: J1.B5 4.6,13.49 3.81,12.7 R2.2
N$8
  Top 0.254: LD2.A R6.2
N$9
  Top 0.254: IC1.29 25.91,12.19 26.92,11.18 26.93,11.18 27.69,10.42 C11.2
N$10  (via drill 0.35)
  Top 0.254: IC1.22 23.61,8.37 v23.11,7.87 | v35,22.15 34.62,22.53 30.25,22.53 29.38,23.41 LD3.A
  Bottom 0.254: v23.11,7.87 24.89,7.87 26.16,6.6 39.09,6.6 40.39,7.9 40.39,22.35 40.13,22.61 35.46,22.61 v35,22.15
N$11
  Top 0.254: R7.2 32.01,23.61 31.75,23.88 LD3.K
N$12
  Top 0.254: IC4.6 23.24,22.15 24.13,23.04 26.18,23.04 26.3,23.16 JP1.1
N$13
  Top 0.254: R5.2 LD1.K
N$17
  Top 0.254: Q5.1 34.1,13.14 33.19,14.05 Q1.3 30.59,14.05 29.75,13.22 R11.2
N$19
  Top 0.254: R14.2 29.52,19.57 30.05,19.04 30.05,17.21 30.84,16.43 Q3.3 33.44,16.43 34.54,17.53 35.05,17.53 35.31,17.78 35.31,18.29 35.64,18.63 Q6.1
OUT_1  (via drill 0.35)
  Top 0.762: Q5.3 Q2.3 41.32,14.05 41.88,13.49 J2.1 D2.A | LD2.K v42.67,18.8 | D3.C 46.74,8.31 44.75,10.29 D2.A | D2.A 44.49,10.5 LD1.A
  Bottom 0.762: v42.67,18.8 42.77,18.69 42.77,16.21 44.7,14.28 J2.1
OUT_2  (via drill 0.35)
  Top 0.762: 40.67,16.43 41.32,16.43 41.88,16.99 J2.2 44.68,17.02 D4.A 44.68,21.82 44.93,22.07 45.95,22.07 46.74,22.86 D5.C 46.74,24.38 46.3,24.82 44.63,24.82 44.12,25.32 43.1,25.32 42.67,24.89 R6.1 | 40.67,16.43 Q4.3 Q6.3 | R5.1 41.66,5.83 41.15,6.35 41.15,11.18 v41.66,11.68 | v41.71,15.39 40.67,16.43
  Bottom 0.762: v41.71,15.39 41.71,11.73 v41.66,11.68
RX  (via drill 0.35)
  Top 0.254: v8.38,9.91 9.53,8.76 17.5,8.76 19.93,11.19 IC1.14
  Bottom 0.254: J4.5 30.1,27.56 8.38,27.56 5.79,24.97 2.74,24.97 1.7,23.93 1.7,21.29 2.06,20.93 6.45,20.93 7.24,20.14 7.24,11.81 8.38,10.67 v8.38,9.91
SCL  (via drill 0.35)
  Top 0.254: J4.3 26.67,27.18 25.76,26.26 22.2,26.26 20.82,24.88 R9.1 20.7,23.76 IC4.8 20.7,20.68 v20.83,20.55 | IC1.6 22.11,15 21.31,15.8 21.31,18.06 20.83,18.54 v20.45,18.54
  Bottom 0.254: v20.45,18.54 20.14,18.85 20.14,19.86 v20.83,20.55
SDA
  Top 0.254: IC1.5 22.61,15.44 22.66,15.49 22.66,19.81 21.97,20.5 IC4.7 21.97,22.23 22.73,22.99 23.19,22.99 23.61,23.41 R8.2 23.61,24.63 24.26,25.27 26.8,25.27 29.21,27.69 J4.4
SWCLK  (via drill 0.35)
  Top 0.254: IC1.31 26.4,13.19 28.25,15.04 28.25,17.42 v28.3,17.42 | J3.4 40.64,27.15 41.45,26.34 v41.45,22.28
  Bottom 0.254: v28.3,17.42 28.8,17.42 29.92,18.54 29.92,23.09 30.38,23.55 40.69,23.55 41.45,22.78 v41.45,22.28
SWDIO  (via drill 0.35)
  Top 0.254: IC1.32 26.18,13.69 27.63,15.13 27.63,18.44 v27.46,18.62
  Bottom 0.254: v27.46,18.62 27.46,19.56 27.71,19.81 27.71,24.31 29.29,25.88 40.62,25.88 41.91,27.18 J3.2
TX  (via drill 0.35)
  Top 0.254: IC1.13 19.79,11.69 17.75,9.65 10.92,9.65 v9.14,11.43
  Bottom 0.254: v9.14,11.43 8.13,12.45 8.13,20.57 6.86,21.84 3.28,21.84 2.64,22.48 2.64,23.42 3.23,24 6.73,24 9.45,26.72 31.83,26.72 34.29,29.18 J4.6
VDD  (via drill 0.35)
  Top 0.254: IC1.30 25.9,12.69 25.91,12.7 26.91,12.7 27.43,13.22 C13.1 | IC1.9 20.35,13.69 19.8,14.23 C12.1
  Top 0.762: C3.1 15.93,12.96 C4.1 17.21,12.89 17.78,13.46 | v24.89,19.56 26.41,19.56 R17.2 28.24,19.57 v28.83,18.97 29.23,18.57 29.23,15.01 27.84,13.61 C13.1 | 17.78,16.51 17.78,13.46 | 17.78,16.51 17.78,17.53 | J4.2 24.13,27.94 23.52,27.33 20.68,27.33 19.3,25.96 19.3,22.3 17.78,20.78 17.78,17.53 | IC2.5 17.71,16.44 17.78,16.51 | 17.78,17.53 R16.2 C14.1 19.36,18.79 20.07,19.5 21.62,19.5 v21.62,19.42 21.97,19.07 IC4.2 | J3.1 42.32,28.88 43,28.19 v43,26.24 | 17.78,13.46 18.55,14.23 C12.1
  Bottom 0.762: v21.62,19.42 22.18,19.98 24.47,19.98 v24.89,19.56 | v43,26.24 41.55,24.79 29.82,24.79 28.83,23.8 v28.83,18.97
XFAST/RIGHT
  Top 0.254: S3.2 28.13,5.04 26.1,3.01 22.16,3.01 20.13,5.04 S3.1 21.61,8.56 IC1.18

### Text on the board
tPlace: GND / VCC / SCL / SDA / RX / TX | PWR | RST | FAST | XFAST | MIN. RESET | OK
bPlace: Version: 1.0 | Note: | For future use/hacking: | OK | Pragotron Master Clock | - for IPJ 0612 and others / - 24V pulse source, using precise RTC with a temperature compensation / - power with a regular USB power brick / - click FAST/XFAST to toggle scrolling through the numbers / - click MINUTE RESET to set the current minute to 0s / - hack using provided I2C and Serial ports | Made by Vaclav Mach, open source / github.com/xx0x/pragotron-master-clock